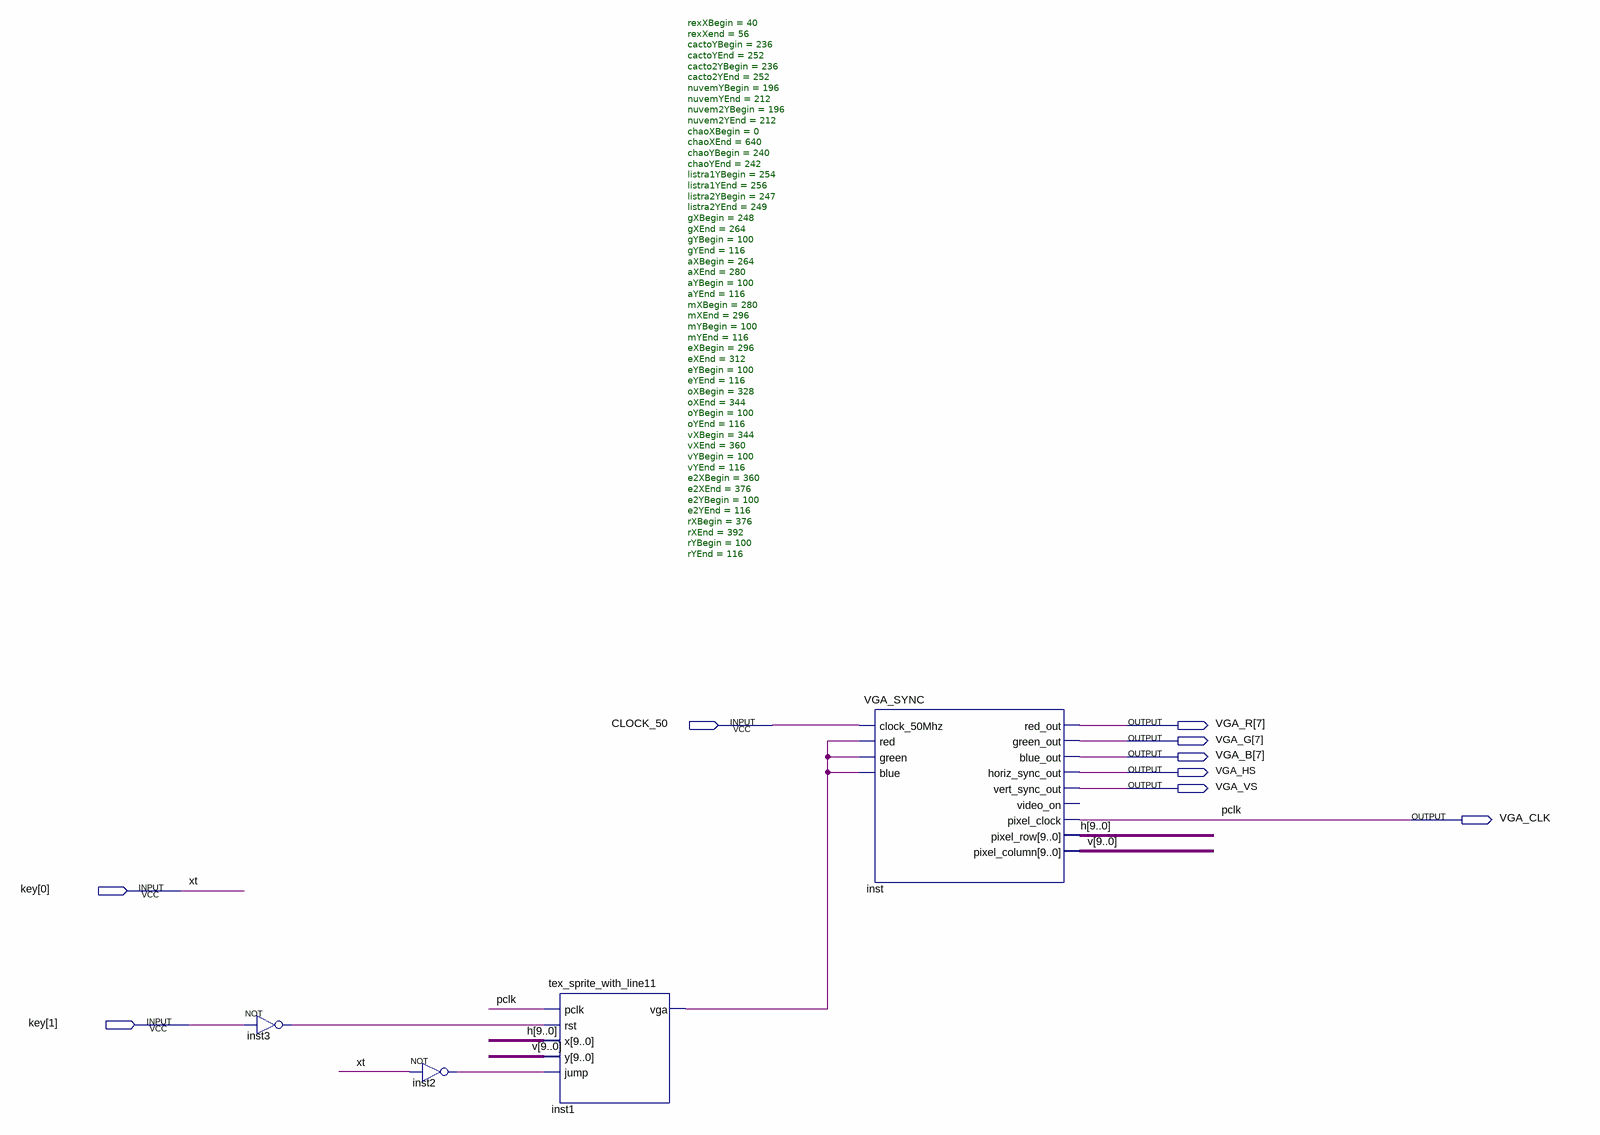
[diagram p0: schematic sheet]
// Quartus schematic rex_game.bdf as structural Verilog: 4 symbols, 9 pins
module rex_game (
  input  CLOCK_50,
  input  [1:0] key,
  output [7:7] VGA_R,
  output [7:7] VGA_G,
  output [7:7] VGA_B,
  output VGA_HS,
  output VGA_VS,
  output VGA_CLK
);

  wire inst1_vga, inst2_out, inst3_out;
  wire [9:0] h, v;

  not inst3 (inst3_out, key[1]);
  not inst2 (inst2_out, key[0]);
  tex_sprite_with_line11 #(.rexXBegin(40), .rexXend(56), .cactoYBegin(236), .cactoYEnd(252), .cacto2YBegin(236), .cacto2YEnd(252), .nuvemYBegin(196), .nuvemYEnd(212), .nuvem2YBegin(196), .nuvem2YEnd(212), .chaoXBegin(0), .chaoXEnd(640), .chaoYBegin(240), .chaoYEnd(242), .listra1YBegin(254), .listra1YEnd(256), .listra2YBegin(247), .listra2YEnd(249), .gXBegin(248), .gXEnd(264), .gYBegin(100), .gYEnd(116), .aXBegin(264), .aXEnd(280), .aYBegin(100), .aYEnd(116), .mXBegin(280), .mXEnd(296), .mYBegin(100), .mYEnd(116), .eXBegin(296), .eXEnd(312), .eYBegin(100), .eYEnd(116), .oXBegin(328), .oXEnd(344), .oYBegin(100), .oYEnd(116), .vXBegin(344), .vXEnd(360), .vYBegin(100), .vYEnd(116), .e2XBegin(360), .e2XEnd(376), .e2YBegin(100), .e2YEnd(116), .rXBegin(376), .rXEnd(392), .rYBegin(100), .rYEnd(116)) inst1 (
    .pclk(VGA_CLK), .rst(inst3_out), .x(h), .y(v), .jump(inst2_out), .vga(inst1_vga));
  VGA_SYNC inst (
    .clock_50Mhz(CLOCK_50), .red(inst1_vga), .green(inst1_vga), .blue(inst1_vga), .red_out(VGA_R[7]),
    .green_out(VGA_G[7]), .blue_out(VGA_B[7]), .horiz_sync_out(VGA_HS), .vert_sync_out(VGA_VS),
    .pixel_clock(VGA_CLK), .pixel_row(h), .pixel_column(v));  // open: video_on

  // Other names for the same wires on the sheet: pclk = VGA_CLK; xt = key[0]
endmodule
